# Altium schematic sheet CPU2.SchDoc
size A
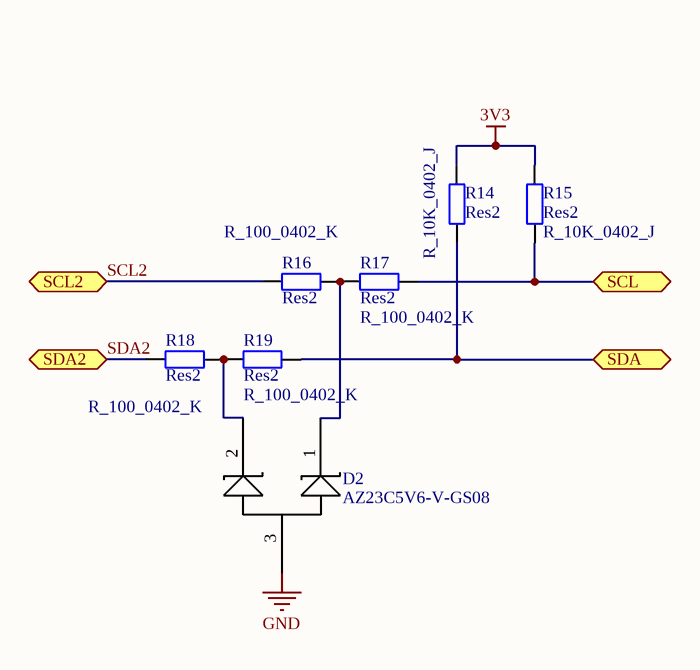
[diagram p0: CPU2.SchDoc]

## Parts
D2  AZ23C5V6-V-GS08  [SOT-23_N]
R14  Res2  value R_10K_0402_J  [R_0402]
R15  Res2  value R_10K_0402_J  [R_0402]
R16  Res2  value R_100_0402_K  [R_0402]
R17  Res2  value R_100_0402_K  [R_0402]
R18  Res2  value R_100_0402_K  [R_0402]
R19  Res2  value R_100_0402_K  [R_0402]

## Ports
SCL, SCL2, SDA, SDA2

## Nets
3V3: R14.2 R15.2
GND: D2.3
SCL: R15.1 R17.2 ; port SCL
SCL2: R16.1 ; port SCL2
SDA: R14.1 R19.2 ; port SDA
SDA2: R18.1 ; port SDA2
NetD2_1: D2.1 R16.2 R17.1
NetD2_2: D2.2 R18.2 R19.1

## Library data of the parts
D2 = AZ23C5V6-V-GS08: Zener Diodes 5.6 Volt 0.3W 5% CA; Manufacturer: Vishay Semiconductors; Power Dissipation: 300 mW; Zener Current: 5 mA; Maximum Zener Impedance: 40 Ohms; Voltage Temperature Coefficient: 0.02 % / C; Zener Voltage: 5.2 V to 6 V; Manufacturer Part Number: AZ23C5V6-V-GS08; RoHS: RoHS Compliant By Exemption; Category: Zener Diodes; Stock 1: 26255; Pricing 1: 1=0.070, 10=0.050, 50=0.049, 100=0.048, 500=0.041, 1000=0.038, 3000=0.037, 9000=0.036, 18000=0.035 (USD); Package / Case: SOT-23; Packaging: Reel; Mounting Style: SMD/SMT; Maximum Operating Temperature: + 150 C; Minimum Operating Temperature: - 65 C; Product Category: Zener Diodes; Standard Pack Qty: 15000; Voltage Tolerance: 5 %; RoHS - Mouser: E; Minimum Order Quantity: 1; Reeling: True; ComponentLink1URL: http://www.vishay.com/doc?85759; ComponentLink1Description: http://www.vishay.com/doc?85759; Supplier 1: DigiKey; Supplier Part Number 1: 78-AZ23C5V6-V; Supplier 2: Mouser; Supplier Part Number 2: 78-AZ23C5V6-V
R14-R19 = Res2: Resistor; Published: 8-Jun-2000; LatestRevisionDate: 17-Jul-2002; LatestRevisionNote: Re-released for DXP Platform.; Publisher: Altium Limited; Supplier 1: Digi-Key
  R14 R15: Supplier Part Number 1: P10KJCT-ND; Supplier 2: Mouser; Supplier Part Number 2: 667-ERJ-2GEJ103X
  R16-R19: Supplier Part Number 1: P100JTR-ND